# EAGLE design Main_mixer (EAGLE 7.1.0)
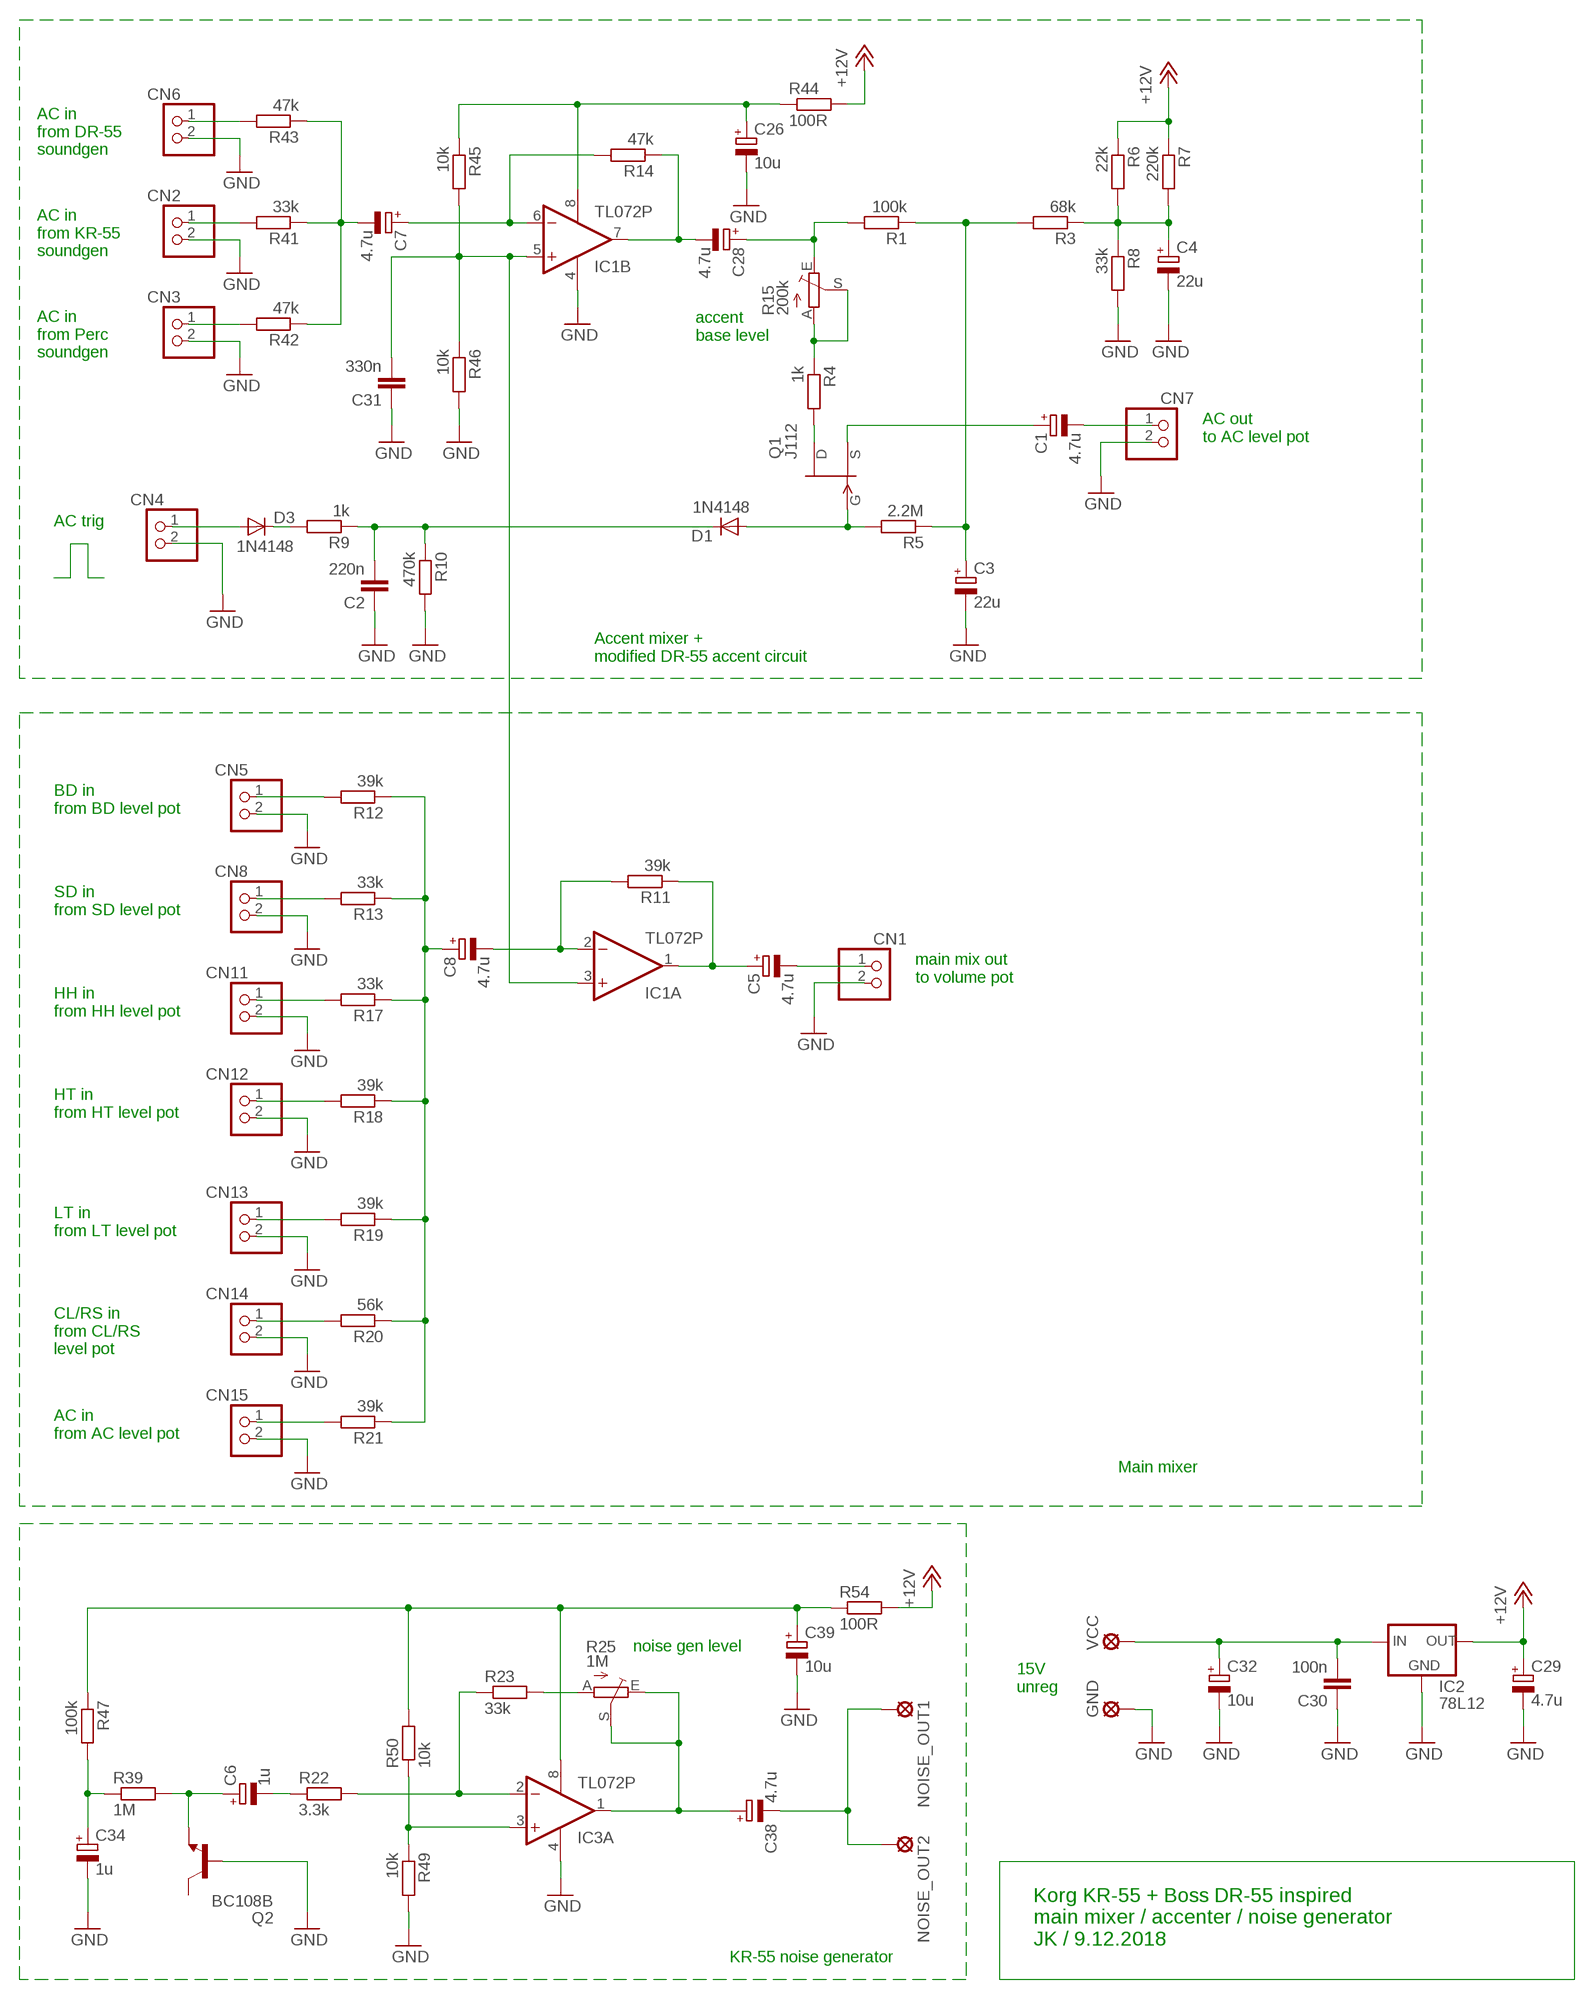
[diagram p0: schematic, sheet 1]

## Parts
C1  4.7u  CPOL-EUSMCA  [SMC_A]
C2  220n  C-EUC0805  [C0805]
C3  22u  CPOL-EUE5-5  [E5-5]
C4  22u  CPOL-EUE5-5  [E5-5]
C5  4.7u  CPOL-EUSMCA  [SMC_A]
C6  1u  CPOL-EUSMCA  [SMC_A]
C7  4.7u  CPOL-EUSMCA  [SMC_A]
C8  4.7u  CPOL-EUSMCA  [SMC_A]
C26  10u  CPOL-EUE2.5-5  [E2,5-5]
C28  4.7u  CPOL-EUSMCA  [SMC_A]
C29  4.7u  CPOL-EUSMCA  [SMC_A]
C30  100n  C-EUC0805  [C0805]
C31  330n  C-EUC0805  [C0805]
C32  10u  CPOL-EUE2.5-5  [E2,5-5]
C34  1u  CPOL-EUSMCA  [SMC_A]
C38  4.7u  CPOL-EUSMCA  [SMC_A]
C39  10u  CPOL-EUE2.5-5  [E2,5-5]
CN1  PINHD-1X2  [1X02]
CN2  PINHD-1X2  [1X02]
CN3  PINHD-1X2  [1X02]
CN4  PINHD-1X2  [1X02]
CN5  PINHD-1X2  [1X02]
CN6  PINHD-1X2  [1X02]
CN7  PINHD-1X2  [1X02]
CN8  PINHD-1X2  [1X02]
CN11  PINHD-1X2  [1X02]
CN12  PINHD-1X2  [1X02]
CN13  PINHD-1X2  [1X02]
CN14  PINHD-1X2  [1X02]
CN15  PINHD-1X2  [1X02]
D1  1N4148  DIODE-SOD80C  [SOD80C]
D3  1N4148  DIODE-SOD80C  [SOD80C]
GND  LSP10  [LSP10]
IC1  TL072P  [DIL08]
IC2  78L12  78LXX  [78LXX]
IC3  TL072P  [DIL08]
NOISE_OUT1  LSP10  [LSP10]
NOISE_OUT2  LSP10  [LSP10]
Q1  J112  BF245  [TO92]
Q2  BC108B  [TO18]
R1  100k  R-EU_R0805  [R0805]
R3  68k  R-EU_R0805  [R0805]
R4  1k  R-EU_R0805  [R0805]
R5  2.2M  R-EU_R0805  [R0805]
R6  22k  R-EU_R0805  [R0805]
R7  220k  R-EU_R0805  [R0805]
R8  33k  R-EU_R0805  [R0805]
R9  1k  R-EU_R0805  [R0805]
R10  470k  R-EU_R0805  [R0805]
R11  39k  R-EU_R0805  [R0805]
R12  39k  R-EU_R0805  [R0805]
R13  33k  R-EU_R0805  [R0805]
R14  47k  R-EU_R0805  [R0805]
R15  200k  TRIM_EU-S63X  [S63X]
R17  33k  R-EU_R0805  [R0805]
R18  39k  R-EU_R0805  [R0805]
R19  39k  R-EU_R0805  [R0805]
R20  56k  R-EU_R0805  [R0805]
R21  39k  R-EU_R0805  [R0805]
R22  3.3k  R-EU_R0805  [R0805]
R23  33k  R-EU_R0805  [R0805]
R25  1M  TRIM_EU-S63X  [S63X]
R39  1M  R-EU_R0805  [R0805]
R41  33k  R-EU_R0805  [R0805]
R42  47k  R-EU_R0805  [R0805]
R43  47k  R-EU_R0805  [R0805]
R44  100R  R-EU_R0805  [R0805]
R45  10k  R-EU_R0805  [R0805]
R46  10k  R-EU_R0805  [R0805]
R47  100k  R-EU_R0805  [R0805]
R49  10k  R-EU_R0805  [R0805]
R50  10k  R-EU_R0805  [R0805]
R54  100R  R-EU_R0805  [R0805]
VCC  LSP10  [LSP10]

## Nets
+12V: C29.+ IC2.OUT R6.1 R7.1 R44.2 R54.2
+15V: C30.2 C32.+ IC2.IN VCC.MP
GND: C2.1 C3.- C4.- C26.- C29.- C30.1 C31.1 C32.- C34.- C39.- CN1.2 CN2.2 CN3.2 CN4.2 CN5.2 CN6.2 CN7.2 CN8.2 CN11.2 CN12.2 CN13.2 CN14.2 CN15.2 GND.MP IC1.4(P:V-) IC2.GND IC3.4(P:V-) Q2.2(B) R8.2 R10.2 R46.2 R49.2
N$1: C31.2 IC1.3(A:+IN) IC1.5(B:+IN) R45.2 R46.1
N$2: CN6.1 R43.2
N$3: CN2.1 R41.2
N$4: CN3.1 R42.2
N$5: CN4.1 D3.A
N$6: D3.C R9.2
N$7: C2.2 D1.C R9.1 R10.1
N$8: D1.A Q1.3(G) R5.2
N$9: C28.+ R1.2 R15.E
N$10: C3.+ R1.1 R3.2 R5.1
N$11: C8.+ R12.1 R13.1 R17.1 R18.1 R19.1 R20.1 R21.1
N$12: R4.1 R15.A R15.S
N$13: Q1.1(D) R4.2
N$14: C1.+ Q1.2(S)
N$15: C1.- CN7.1
N$16: CN5.1 R12.2
N$17: C4.+ R3.1 R6.2 R7.2 R8.1
N$18: CN8.1 R13.2
N$19: CN11.1 R17.2
N$20: CN12.1 R18.2
N$21: CN13.1 R19.2
N$22: CN14.1 R20.2
N$23: CN15.1 R21.2
N$24: C5.+ IC1.1(A:OUT) R11.1
N$25: C5.- CN1.1
N$26: C7.+ IC1.6(B:-IN) R14.2
N$27: R23.2 R25.A
N$28: C38.+ IC3.1(A:OUT) R25.E R25.S
N$29: IC3.2(A:-IN) R22.2 R23.1
N$30: C6.- R22.1
N$31: C6.+ Q2.1(E) R39.2
N$32: C34.+ R39.1 R47.2
N$33: C38.- NOISE_OUT1.MP NOISE_OUT2.MP
N$35: C8.- IC1.2(A:-IN) R11.2
N$42: C28.- IC1.7(B:OUT) R14.1
N$43: C7.- R41.1 R42.1 R43.1
N$53: IC3.3(A:+IN) R49.1 R50.1
V_BD: C39.+ IC3.8(P:V+) R47.1 R50.2 R54.1
V_MX: C26.+ IC1.8(P:V+) R44.1 R45.1
Unconnected: IC3.5(B:+IN) IC3.6(B:-IN) IC3.7(B:OUT) Q2.3(C)

## Notes on the sheet
- AC in
  from DR-55
  soundgen
- AC in
  from KR-55
  soundgen
- accent
  base level
- AC in
  from Perc
  soundgen
- AC out
  to AC level pot
- AC trig
- Accent mixer +
  modified DR-55 accent circuit
- BD in
  from BD level pot
- SD in
  from SD level pot
- main mix out
  to volume pot
- HH in
  from HH level pot
- HT in
  from HT level pot
- LT in
  from LT level pot
- CL/RS in
  from CL/RS
  level pot
- AC in
  from AC level pot
- Main mixer
- noise gen level
- 15V
  unreg
- Korg KR-55 + Boss DR-55 inspired 
  main mixer / accenter / noise generator
  JK / 9.12.2018
- KR-55 noise generator

## Library data of the parts
C1 C3-C8 C26 C28 C29 C32 C34 C38 C39 = rcl:CPOL-EU: POLARIZED CAPACITOR, European symbol
C2 C30 C31 = rcl:C-EU: CAPACITOR, European symbol
CN1-CN8 CN11-CN15 = pinhead:PINHD-1X2: PIN HEADER
D1 D3 = diode:DIODE-: DIODE
GND NOISE_OUT1 NOISE_OUT2 VCC = solpad:LSP10: SOLDER PAD drill 1.0 mm, distributor Buerklin, 12H555
IC1 IC3 = linear:TL072: OP AMP
IC2 = v-reg:78LXX: VOLTAGE REGULATOR
Q1 = transistor-fet:BF245: N-Channel Junction FET http://www.onsemi.com/pub/Collateral/BF245A-D.PDF
Q2 = transistor-npn:BC108B: NPN Transistor
R1 R3-R14 R17-R23 R39 R41-R47 R49 R50 R54 = rcl:R-EU_: RESISTOR, European symbol
R15 R25 = pot:TRIM_EU-: POTENTIOMETER

## Board
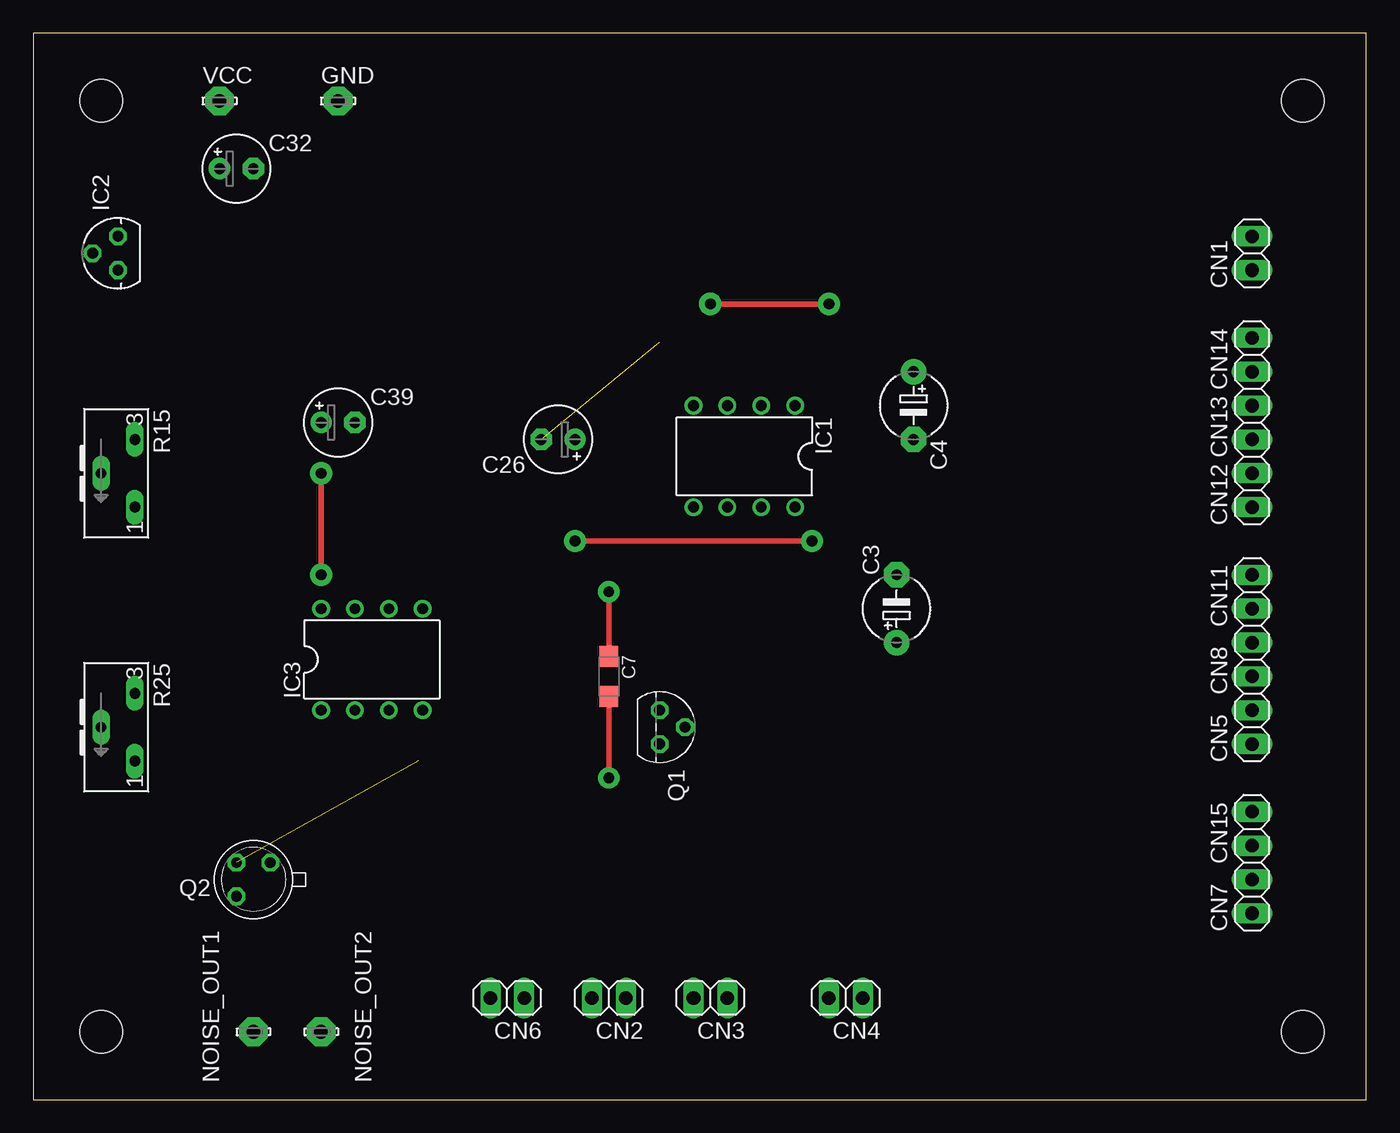
[diagram p1: board, top side]
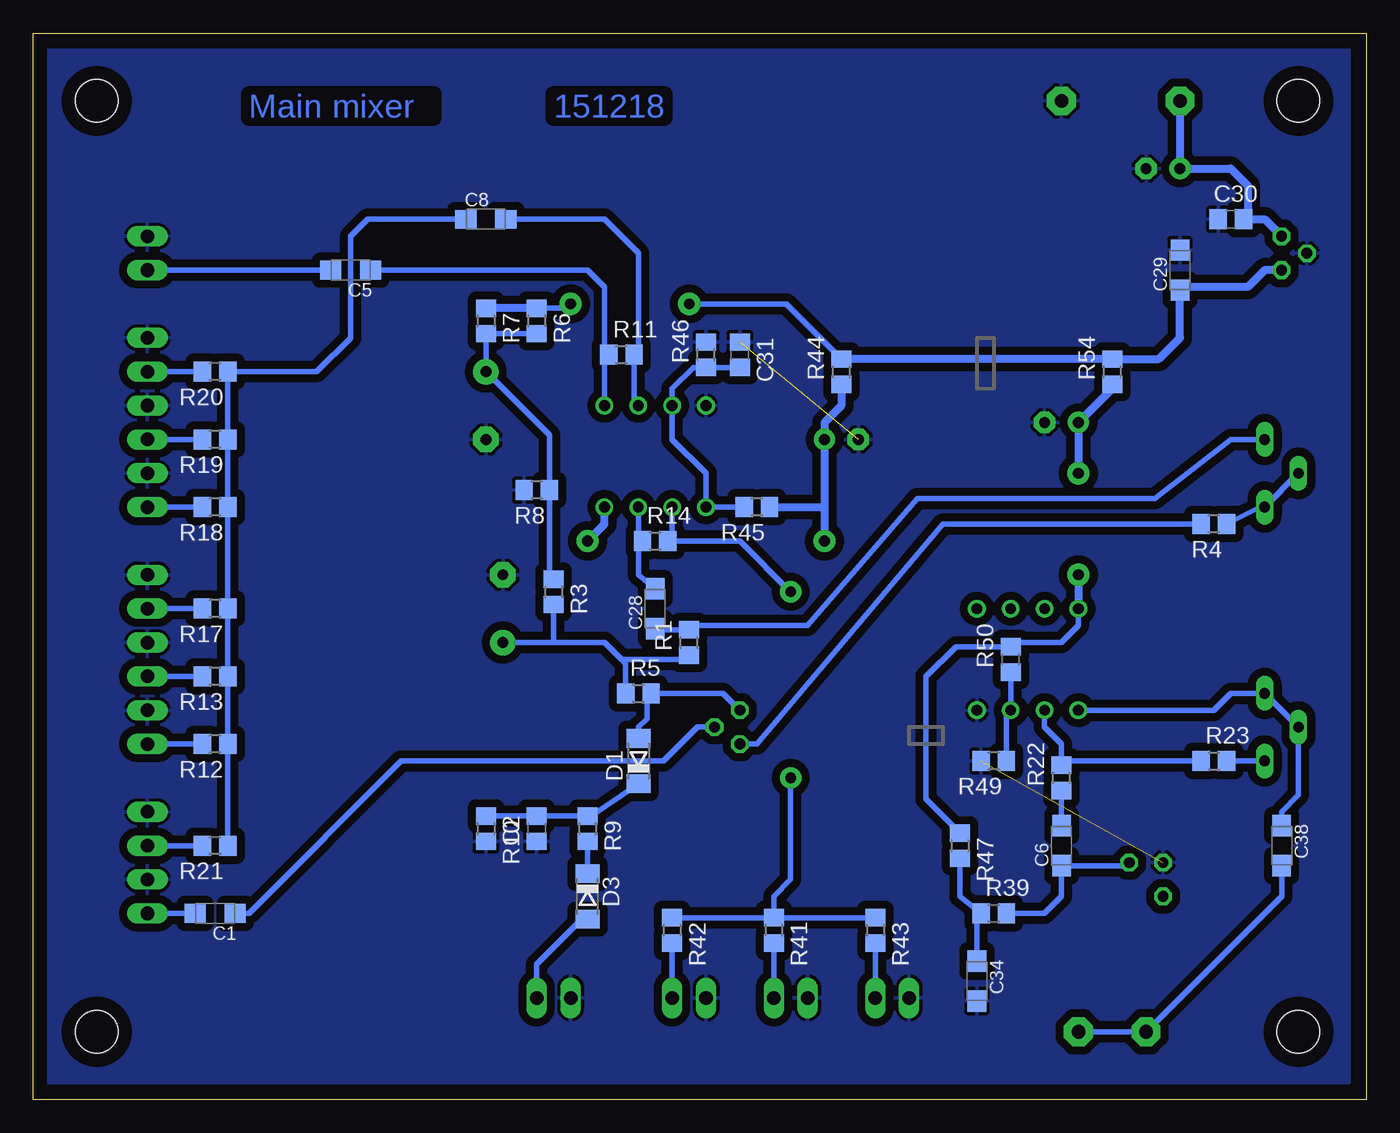
[diagram p2: board, bottom side, seen from below]

Size 100 x 80 mm. Coordinates in mm from the lower left corner, seen from the top.
Outline: 0,0 100,0 100,80 0,80 0,0
Copper layers (1*16): Top 0.035mm / dielectric 1.5mm / Bottom 0.035mm
Design rules "default": minimum track width 10mil, minimum drill 24mil, track to track 8mil, track to pad 8mil, pad to pad 8mil, via to via 8mil, smd to smd 8mil, copper to edge 40mil, drill to drill 8mil, minimum pad ring 10mil, minimum via ring 8mil, stop-mask expansion 4mil, vias tented up to drill 0mil, thermal gap 10mil
Holes 3.2 mm at 5.08,74.93 5.08,5.08 95.25,5.08 95.25,74.93

### Footprints (pad centres in the part's own frame; a part is rotated, then mirrored left to right if it is on the bottom)
SMC_A = smd 1.6 x 1.4: + -1.5,0; - 1.5,0
C0805 = smd 1.3 x 1.5: 1 -0.95,0; 2 0.95,0
E5-5 = drill 0.813 pad 1.905: + -2.54,0 | drill 0.813 pad 1.905 octagon: - 2.54,0
E2,5-5 = drill 0.813 pad 1.6: + -1.27,0 | drill 0.813 pad 1.6 octagon: - 1.27,0
1X02 = drill 1.016 long: 1 -1.27,0; 2 1.27,0
SOD80C = smd 1.4 x 1.8: A 1.7,0; C -1.7,0
LSP10 = drill 1.016 pad 2.159 octagon: MP 0,0
DIL08 = drill 0.813 pad 1.27: 1 -3.81,-3.81; 2 -1.27,-3.81; 3 1.27,-3.81; 4 3.81,-3.81; 5 3.81,3.81; 6 1.27,3.81; 7 -1.27,3.81; 8 -3.81,3.81
78LXX = drill 0.813 octagon: GND 0,1.905; IN 1.27,0; OUT -1.27,0
TO92 = drill 0.813 octagon: 1 1.27,0; 2 0,1.905; 3 -1.27,0
TO18 = drill 0.813 octagon: 1 -1.27,-1.27; 2 1.27,-1.27; 3 1.27,1.27
R0805 = smd 1.3 x 1.5: 1 -0.95,0; 2 0.95,0
S63X = drill 0.813 long: A 2.54,0; E -2.54,0; S 0,-2.54

### Placement (x,y rotation side)
C1  86.36,13.97 180 bottom
C2  62.23,20.32 90 bottom
C3  64.77,36.83 90 top
C4  66.04,52.07 270 top
C5  76.2,62.23 180 bottom
C6  22.86,19.05 90 bottom
C7  43.18,31.75 270 top
C8  66.04,66.04 0 bottom
C26  39.37,49.53 180 top
C28  53.34,36.83 90 bottom
C29  13.97,62.23 90 bottom
C30  10.16,66.04 0 bottom
C31  46.99,55.88 270 bottom
C32  15.24,69.85 0 top
C34  29.21,8.89 270 bottom
C38  6.35,19.05 270 bottom
C39  22.86,50.8 0 top
CN1  91.44,63.5 90 top
CN2  43.18,7.62 180 top
CN3  50.8,7.62 180 top
CN4  60.96,7.62 180 top
CN5  91.44,27.94 90 top
CN6  35.56,7.62 180 top
CN7  91.44,15.24 90 top
CN8  91.44,33.02 90 top
CN11  91.44,38.1 90 top
CN12  91.44,45.72 90 top
CN13  91.44,50.8 90 top
CN14  91.44,55.88 90 top
CN15  91.44,20.32 90 top
D1  54.61,25.4 90 bottom
D3  58.42,15.24 270 bottom
GND  22.86,74.93 0 top
IC1  53.34,48.26 180 top
IC2  6.35,63.5 90 top
IC3  25.4,33.02 0 top
NOISE_OUT1  16.51,5.08 0 top
NOISE_OUT2  21.59,5.08 0 top
Q1  46.99,27.94 270 top
Q2  16.51,16.51 180 top
R1  50.8,34.29 90 bottom
R3  60.96,38.1 270 bottom
R4  11.43,43.18 180 bottom
R5  54.61,30.48 0 bottom
R6  62.23,58.42 270 bottom
R7  66.04,58.42 270 bottom
R8  62.23,45.72 180 bottom
R9  58.42,20.32 270 bottom
R10  66.04,20.32 270 bottom
R11  55.88,55.88 0 bottom
R12  86.36,26.67 180 bottom
R13  86.36,31.75 180 bottom
R14  53.34,41.91 0 bottom
R15  7.62,46.99 270 top
R17  86.36,36.83 180 bottom
R18  86.36,44.45 180 bottom
R19  86.36,49.53 180 bottom
R20  86.36,54.61 180 bottom
R21  86.36,19.05 180 bottom
R22  22.86,24.13 90 bottom
R23  11.43,25.4 0 bottom
R25  7.62,27.94 270 top
R39  27.94,13.97 0 bottom
R41  44.45,12.7 270 bottom
R42  52.07,12.7 270 bottom
R43  36.83,12.7 270 bottom
R44  39.37,54.61 90 bottom
R45  45.72,44.45 180 bottom
R46  49.53,55.88 90 bottom
R47  30.48,19.05 270 bottom
R49  27.94,25.4 180 bottom
R50  26.67,33.02 90 bottom
R54  19.05,54.61 90 bottom
VCC  13.97,74.93 0 top

### Tracks (layer width: path | path; a pad name or v marks a point on that pad's centre or on a via)
+12V  (via drill 0.8 pad 1.68)
  Top 0.406: v59.69,59.69 v50.8,59.69
  Bottom 0.406: R6.1 60.01,59.37 v59.69,59.69 | v50.8,59.69 43.5,59.69 R44.2
  Bottom 0.61: IC2.OUT 7.62,62.23 8.89,60.96 13.74,60.96 C29.+ 13.97,57.15 15.56,55.56 R54.2 R44.2 | R6.1 R7.1
+15V
  Bottom 0.61: VCC.MP C32.+ 10.16,69.85 8.89,68.58 8.89,66.36 C30.2 7.62,66.04 IC2.IN
GND  (2 unrouted)
  pour Bottom (isolate 0.61): 1.27,78.74 99.06,78.74 99.06,1.27 1.27,1.27
N$1
  Bottom 0.406: C31.2 R46.1 50.48,54.93 52.07,53.34 IC1.3 52.07,49.53 49.53,46.99 IC1.5 R45.2
N$2
  Bottom 0.406: CN6.1 R43.2
N$3
  Bottom 0.406: CN2.1 R41.2
N$4
  Bottom 0.406: CN3.1 R42.2
N$5
  Bottom 0.406: D3.A 58.85,13.54 62.23,10.16 CN4.1
N$6
  Bottom 0.406: R9.2 D3.C
N$7
  Bottom 0.406: D1.C 58.31,21.16 R9.1 C2.2 R10.1
N$8
  Bottom 0.406: D1.A 54.61,27.94 53.98,28.57 53.98,30.16 R5.2 48.26,30.48 Q1.3
N$9
  Bottom 0.406: R15.E 10.16,49.53 15.88,45.09 33.66,45.09 41.91,35.56 50.48,35.56 R1.2 53.25,35.24 C28.+
N$10
  Bottom 0.406: 55.88,33.02 57.15,34.29 60.96,34.29 | 55.88,33.02 51.12,33.02 R1.1 | R5.1 55.56,32.7 55.88,33.02 | C3.+ 60.96,34.29 | R3.2 60.96,34.29
N$11
  Bottom 0.406: R21.1 R12.1 R13.1 R17.1 R18.1 R19.1 R20.1 78.74,54.61 76.2,57.15 76.2,64.77 74.93,66.04 C8.+
N$12
  Bottom 0.406: R15.S R15.A 7.94,44.45 R4.1
N$13
  Bottom 0.406: R4.2 31.75,43.18 45.72,26.67 Q1.1
N$14
  Bottom 0.406: Q1.2 50.16,27.94 52.7,25.4 72.39,25.4 83.82,13.97 C1.+
N$15
  Bottom 0.406: CN7.1 C1.-
N$16
  Bottom 0.406: CN5.1 R12.2
N$17
  Bottom 0.406: R6.2 R7.2 C4.+ 61.28,49.85 R8.1 61.28,39.37 R3.1
N$18
  Bottom 0.406: CN8.1 R13.2
N$19
  Bottom 0.406: CN11.1 R17.2
N$20
  Bottom 0.406: CN12.1 R18.2
N$21
  Bottom 0.406: CN13.1 R19.2
N$22
  Bottom 0.406: CN14.1 R20.2
N$23
  Bottom 0.406: CN15.1 R21.2
N$24
  Bottom 0.406: IC1.1 57.15,55.56 R11.1 57.15,56.2 57.15,60.96 58.42,62.23 C5.+
N$25
  Bottom 0.406: CN1.1 C5.-
N$26  (via drill 0.8 pad 1.6)
  Top 0.406: v43.18,38.1 C7.+
  Bottom 0.406: IC1.6 52.07,42.23 R14.2 46.99,41.91 v43.18,38.1
N$27
  Bottom 0.406: R25.A R23.2
N$28
  Bottom 0.406: IC3.1 11.43,29.21 10.16,30.48 R25.E R25.S 5.08,22.86 6.35,21.59 C38.+
N$29
  Bottom 0.406: R23.1 22.54,25.4 R22.2 22.86,26.67 24.13,27.94 IC3.2
N$30
  Bottom 0.406: R22.1 C6.-
N$31
  Bottom 0.406: Q2.1 18.01,17.55 C6.+ 22.86,15.24 24.13,13.97 R39.2
N$32
  Bottom 0.406: C34.+ 29.21,13.65 R39.1 30.48,15.24 30.48,17.78 30.16,17.78 R47.2
N$33
  Bottom 0.406: C38.- 6.35,15.24 NOISE_OUT1.MP NOISE_OUT2.MP
N$35
  Bottom 0.406: IC1.2 54.93,52.39 R11.2 54.61,56.2 54.61,63.5 57.15,66.04 C8.-
N$42
  Bottom 0.406: IC1.7 54.61,42.23 R14.1 54.61,41.91 54.61,39.37 C28.-
N$43  (via drill 0.8 pad 1.6)
  Top 0.406: v43.18,24.13 C7.-
  Bottom 0.406: R43.1 R41.1 | R41.1 R42.1 | R41.1 44.45,15.24 43.18,16.51 v43.18,24.13
N$53
  Bottom 0.406: R49.1 26.99,28.89 IC3.3 R50.1
V_BD  (via drill 0.8 pad 1.68)
  Top 0.406: v21.59,46.99 v21.59,39.37
  Bottom 0.406: IC3.8 21.59,35.56 22.86,34.29 26.35,34.29 R50.2 30.8,33.97 33.02,31.75 33.02,22.54 R47.1
  Bottom 0.61: R54.1 19.05,53.34 C39.+ v21.59,46.99 | v21.59,39.37 IC3.8
V_MX  (via drill 0.8 pad 1.68)
  Top 0.406: v40.64,41.91 v58.42,41.91
  Bottom 0.61: R44.1 39.37,52.07 40.64,50.8 C26.+ 40.64,44.45 | R45.1 40.64,44.45 | 40.64,44.45 v40.64,41.91 | v58.42,41.91 57.15,43.18 IC1.8

### Text on the board
Bottom: 151218 | Main mixer